# EAGLE design IO4-DCC-Booster (EAGLE 7.7.0)
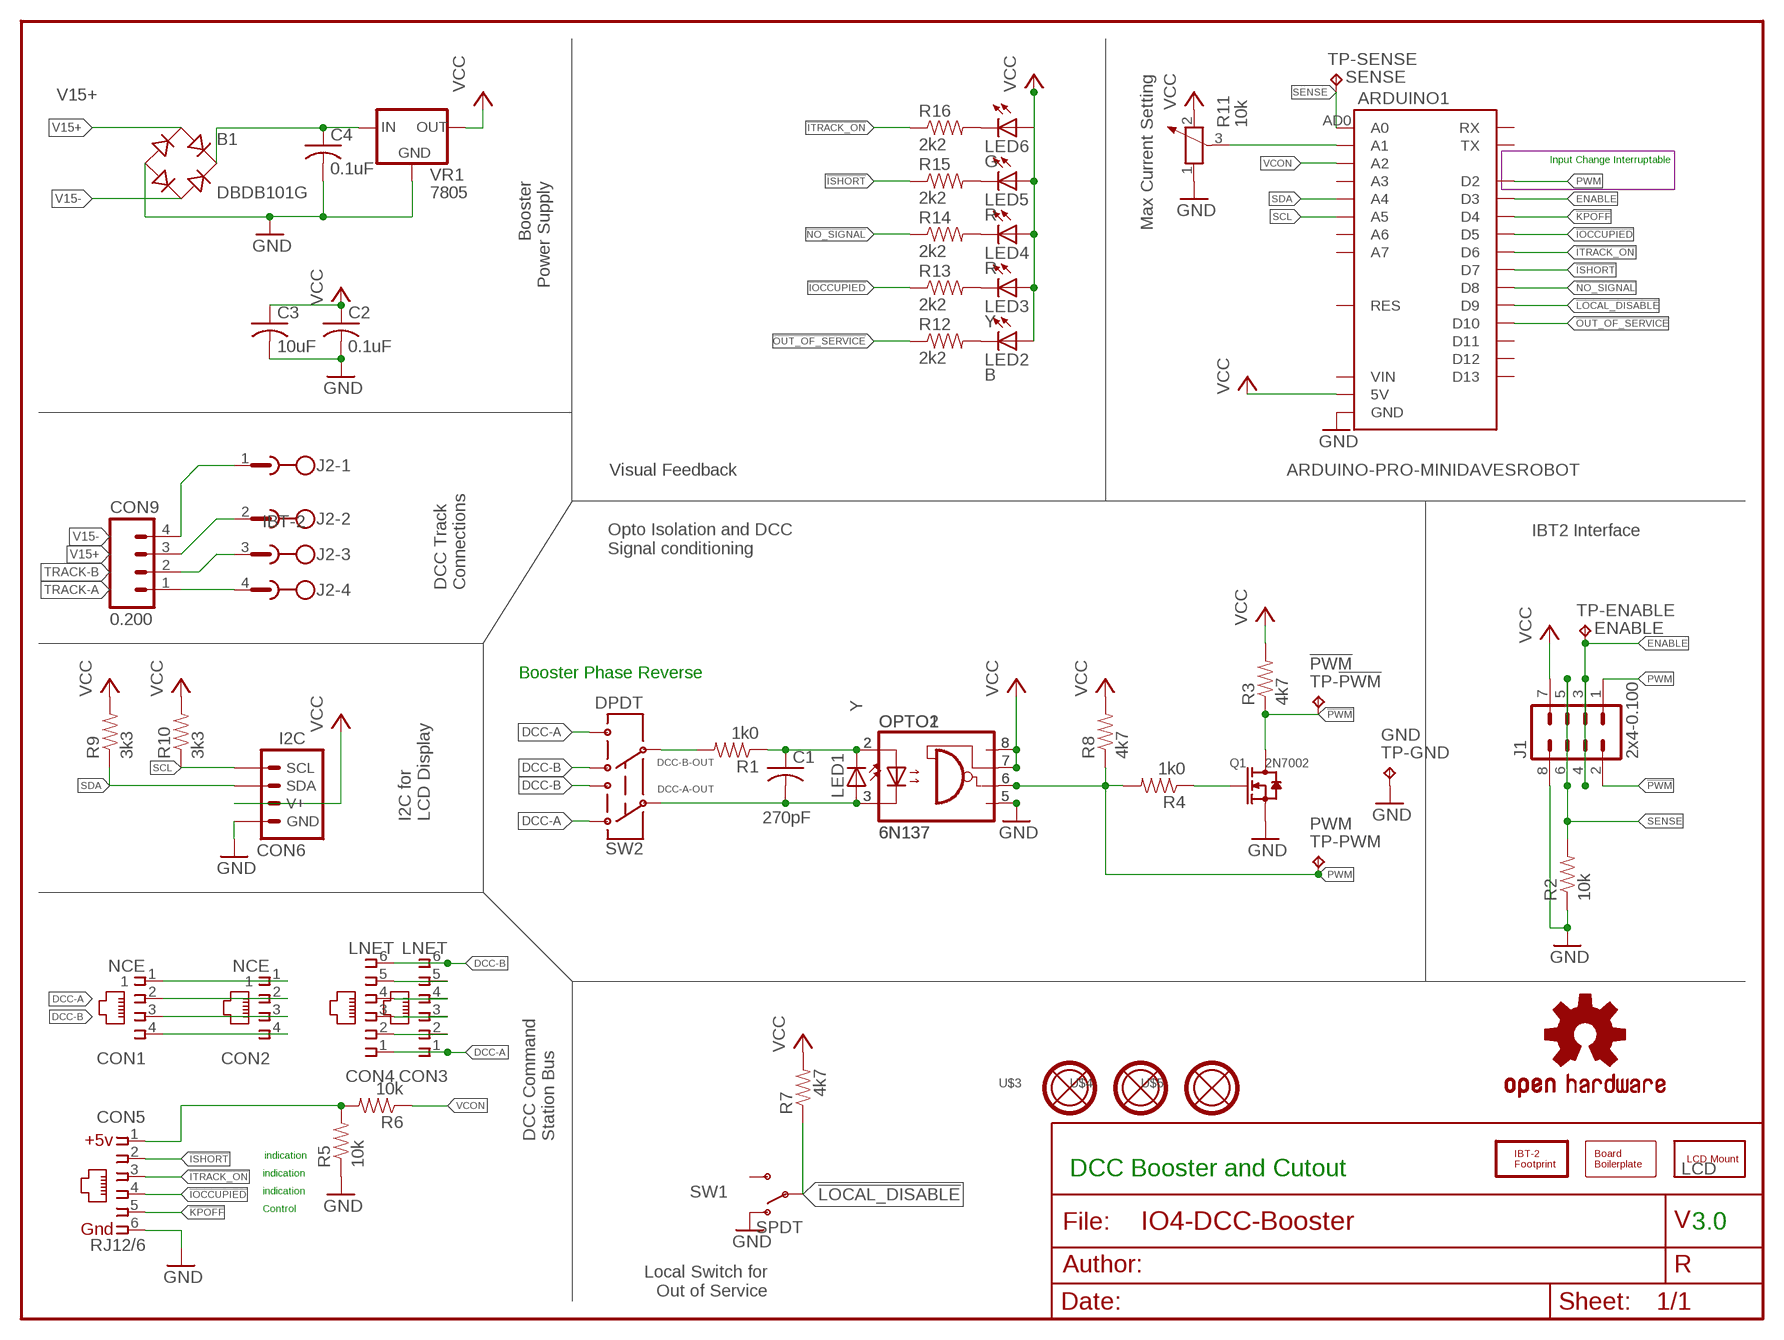
[diagram p0: schematic, sheet 1]

## Parts
ARDUINO1  ARDUINO-PRO-MINIDAVESROBOT  [ARDUINO_PRO_MINI_DAVEK]
B1  DBDB101G  [DB]
BOARD1  BOARD100X100-NOHOLES  [BOARD-SEEED10X10-NOHOLES]
C1  270pF  CAP0805  [0805-CAP]
C2  0.1uF  CAP0805  [0805-CAP]
C3  10uF  CAP0805  [0805-CAP]
C4  0.1uF  CAP0805  [0805-CAP]
CON1  NCE  CONNECTOR-RJ9-4P4C-AMP  [555980-1]
CON2  NCE  CONNECTOR-RJ9-4P4C-AMP  [555980-1]
CON3  LNET  CONNECTOR-RJ25-6P6C  [RJ25-PANEL]
CON4  LNET  CONNECTOR-RJ25-6P6C  [RJ25-PANEL]
CON5  RJ12/6  CONNECTOR-IO4PNL  [RJ25-PANEL]
CON6  I2C  CONNECTOR-I2CLEFT  [I2C-L]
CON9  0.200  CONNECTOR-M045.08  [MSTBA4]
J1  2x4-0.100  MA04-2  [MA04-2]
J2  IBT-2  MSTBA4  [MSTBA4]
LCD  LCD  LCD1602  [LCD-16X2-SILK]
LED1  Y  LED0603-LED  [0603-LED]
LED2  B  LED0603-LED  [0603-LED]
LED3  Y  LED0603-LED  [0603-LED]
LED4  R  LED0603-LED  [0603-LED]
LED5  R  LED0603-LED  [0603-LED]
LED6  G  LED0603-LED  [0603-LED]
LOGO1  DOC-OSHW-LOGO-L  [OSHW-LOGO-L]
OPTO1  6N137  OPTO-6N137  [DIL08]
OPTO2  6N137  OPTO-6N137S  [SM8]
Q1  2N7002  MOSFET-N-2N7002-SOT23  [SOT23]
R1  1k0  R0805-RES  [0805-RES]
R2  10k  R0805-RES  [0805-RES]
R3  4k7  R0805-RES  [0805-RES]
R4  1k0  R0805-RES  [0805-RES]
R5  10k  R0805-RES  [0805-RES]
R6  10k  R0805-RES  [0805-RES]
R7  4k7  R0805-RES  [0805-RES]
R8  4k7  R0805-RES  [0805-RES]
R9  3k3  R0805-RES  [0805-RES]
R10  3k3  R0805-RES  [0805-RES]
R11  10k  R-POTENTIOMETERB25X  [B25X]
R12  2k2  R0805-RES  [0805-RES]
R13  2k2  R0805-RES  [0805-RES]
R14  2k2  R0805-RES  [0805-RES]
R15  2k2  R0805-RES  [0805-RES]
R16  2k2  R0805-RES  [0805-RES]
SW1  SPDT  SWITCH-SPSTPTH-508  [SWITCH-SPDT-508]
SW2  DPDT  SWITCH-DPDTPTH-PB  [8X8-SQ-PB]
TP-!PWM  TPPAD1-13  [P1-13]
TP-ENABLE  TPPAD1-13  [P1-13]
TP-GND  TPPAD1-13  [P1-13]
TP-PWM  TPPAD1-13  [P1-13]
TP-SENSE  TPPAD1-13  [P1-13]
U$2  IBT-2  [IBT-2]
U$3  MOUNTINGHOLE  [MOUNTINGHOLE]
U$4  MOUNTINGHOLE  [MOUNTINGHOLE]
U$5  MOUNTINGHOLE  [MOUNTINGHOLE]
VR1  7805  VREG-DPAK-5  [TO-252]

## Nets
!IOCCUPIED: ARDUINO1.D5 CON5.4 R13.1
!ISHORT: ARDUINO1.D7 CON5.2 R15.1
!ITRACK_ON: ARDUINO1.D6 CON5.3 R16.1
!KPOFF: ARDUINO1.D4 CON5.5
!LOCAL_DISABLE: ARDUINO1.D9 R7.1 SW1.2(P)
!NO_SIGNAL: ARDUINO1.D8 R14.1
!OUT_OF_SERVICE: ARDUINO1.D10 R12.1
!PWM: J1.2 Q1.3(D) R3.1 TP-!PWM.TP
DCC-A: CON1.2 CON2.2 CON3.1 CON4.1 SW2.1A SW2.2B
DCC-A-OUT: C1.2 LED1.A OPTO1.3(C) OPTO2.3(C) SW2.1C
DCC-B: CON1.3 CON2.3 CON3.6 CON4.6 SW2.1B SW2.2A
DCC-B-LIMITED: C1.1 LED1.C OPTO1.2(A) OPTO2.2(A) R1.1
DCC-B-OUT: R1.2 SW2.2C
ENABLE: ARDUINO1.D3 J1.3 J1.4 TP-ENABLE.TP
GND: ARDUINO1.GND@1(GND) ARDUINO1.GND@2(GND) ARDUINO1.GND@4(GND) B1.- C2.2 C3.2 C4.2 CON5.6 CON6.GND CON6.GND@1(GND) J1.8 OPTO1.5(GND) OPTO2.5(GND) Q1.2(S) R2.1 R5.1 R11.1 SW1.1(O) TP-GND.TP VR1.2(GND)
LIMIT: ARDUINO1.AD1(A1) R11.3
N$1: Q1.1(G) R4.1
N$6: CON1.4 CON2.4
N$7: CON1.1 CON2.1
N$8: CON3.5 CON4.5
N$9: CON3.4 CON4.4
N$10: LED4.C R14.2
N$11: CON3.3 CON4.3
N$12: LED2.C R12.2
N$13: LED3.C R13.2
N$14: LED6.C R16.2
N$15: LED5.C R15.2
N$16: CON3.2 CON4.2
N$19: B1.+ C4.1 VR1.1(IN)
PWM: ARDUINO1.D2 J1.1 OPTO1.6(VO) OPTO2.6(VO) R4.2 R8.1 TP-PWM.TP
SCL: ARDUINO1.AD5(A5) CON6.SCL CON6.SCL@1(SCL) R10.1
SDA: ARDUINO1.AD4(A4) CON6.SDA CON6.SDA@1(SDA) R9.1
SENSE: ARDUINO1.AD0(A0) J1.5 J1.6 R2.2 TP-SENSE.TP
TRACK-A: CON9.1 J2.4
TRACK-B: CON9.2 J2.3
V15+: B1.AC1 CON9.3 J2.2
V15-: B1.AC2 CON9.4 J2.1
VCC: ARDUINO1.5V C2.1 C3.1 CON6.V+ CON6.V+@1(V+) J1.7 LED2.A LED3.A LED4.A LED5.A LED6.A OPTO1.7(VE) OPTO1.8(VCC) OPTO2.7(VE) OPTO2.8(VCC) R3.2 R7.2 R8.2 R9.2 R10.2 R11.2 VR1.3(OUT)
VCOMPUTER: CON5.1 R5.2 R6.2
VCON: ARDUINO1.AD2(A2) R6.1
Unconnected: ARDUINO1.AD3(A3) ARDUINO1.AD6(A6) ARDUINO1.AD7(A7) ARDUINO1.D11 ARDUINO1.D12 ARDUINO1.D13 ARDUINO1.RES ARDUINO1.RES@1(RES) ARDUINO1.RX ARDUINO1.TX@1(TX) ARDUINO1.VIN SW1.3(S)

## Notes on the sheet
- Max Current Setting
- Input Change Interruptable
- Booster
  Power Supply
- Visual Feedback
- IBT2 Interface
- Opto Isolation and DCC
  Signal conditioning
- DCC Track
  Connections
- Booster Phase Reverse
- I2C for
  LCD Display
- DCC Command
  Station Bus
- indication
- indication | DCC Booster and Cutout
- indication
- Control
- 3.0
- Local Switch for
  Out of Service

## Library data of the parts
ARDUINO1 = SPCoast:ARDUINO-PRO-MINI
B1 = SPCoast:DB?*G: Single Phase 1.0 AMP Glass Passivated Bridge Rectifier Taiwan Semiconductor Co.,Ltd. - TSC Source: http://www.taiwansemi.com/TSCbig5/ezcatfiles/cust/img/img/db101g.pdf http://www.ts.com.tw/db/pictures/modules/PDT/PDT060207001/DBLS201G.pdf
BOARD1 = SPCoast:BOARD
C1-C4 = SPCoast:CAP*
CON1 CON2 = SPCoast:CONNECTOR-RJ9: RJ9 4P4C jack side mounted The four-position four-conductor (4P4C) connector is the standard modular connector used on both ends of telephone handset cords, and is therefore often called a handset connector. This handset connector is not a registered jack (aka "RJ"), because it was not intended to connect directly to telephone lines. However it is often referred to as RJ9, RJ10, or RJ22. http://www.tycoelectronics.com
CON3 CON4 = SPCoast:CONNECTOR-RJ25: AMP connector; AMP: 520250-3; OPL: none
CON5 = SPCoast:CONNECTOR-IO4
CON6 = SPCoast:CONNECTOR-I2C
CON9 = SPCoast:CONNECTOR-M04: Header 4 Standard 4-pin 0.1" header. Use with straight break away headers (SKU : PRT-00116), right angle break away headers (PRT-00553), swiss pins (PRT-00743), machine pins (PRT-00117), and female headers (PRT-00115). Molex polarized connector foot print use with SKU : PRT-08231 with associated crimp pins and housings. 1MM SMD Version SKU: PRT-10208
J1 = con-lstb:MA04-2: PIN HEADER; OC_FARNELL: unknown; OC_NEWARK: unknown
J2 = con-phoenix-508:MSTBA4: PHOENIX; MF: FARNELL; MPN: 1757268; OC_FARNELL: 3705195; OC_NEWARK: 71C4163
LCD = SPCoast:LCD
LED1-LED6 = SPCoast:LED*
LOGO1 = SPCoast:DOC-OSHW-LOGO-: Open Source Hardware Logo This logo indicates the piece of hardware it is found on incorporates a OSHW license and/or adheres to the definition of open source hardware http://freedomdefined.org/OSHW Creative Commons - Attribution - ShareAlike 3.0
OPTO1 OPTO2 = SPCoast:OPTO-6N137: High Speed OPTO COUPLER Logic Gate output
Q1 = SPCoast:MOSFET-N-*-?: CJ2302：SMD MOSFET N-CH 20V-2.1A DMN4468 - SO8 30v/10A
R1-R10 R12-R16 = SPCoast:R*: Resistor Basic schematic elements and footprints for 0603, 1206, and PTH 1/10th watt (small) resistors.
R11 = SPCoast:R-POTENTIOMETER: Potentiometer
SW1 = SPCoast:SWITCH-SPST: SPST Switch Simple slide switch. Spark Fun Electronics SKU : COM-00102
SW2 = SPCoast:SWITCH-DPDT: DPDT Version of the COM-00597
TP-!PWM = testpad:TP: Test pad; TP_SIGNAL_NAME: !PWM
TP-ENABLE = testpad:TP: Test pad; TP_SIGNAL_NAME: ENABLE
TP-GND = testpad:TP: Test pad; TP_SIGNAL_NAME: GND
TP-PWM = testpad:TP: Test pad; TP_SIGNAL_NAME: PWM
TP-SENSE = testpad:TP: Test pad; TP_SIGNAL_NAME: SENSE
U$2 = SPCoast:IBT-2
U$3-U$5 = SPCoast:MOUNTINGHOLE: Mounting hole with top and bottom copper and stop rings
VR1 = SPCoast:VREG-?-*: Voltage Regulator Standard linear regulator. 7805 uses IGO pinout LM1117 uses GOI pinout

## Net classes
1 Power: width 0.305 mm, clearance 0.254 mm

## Board
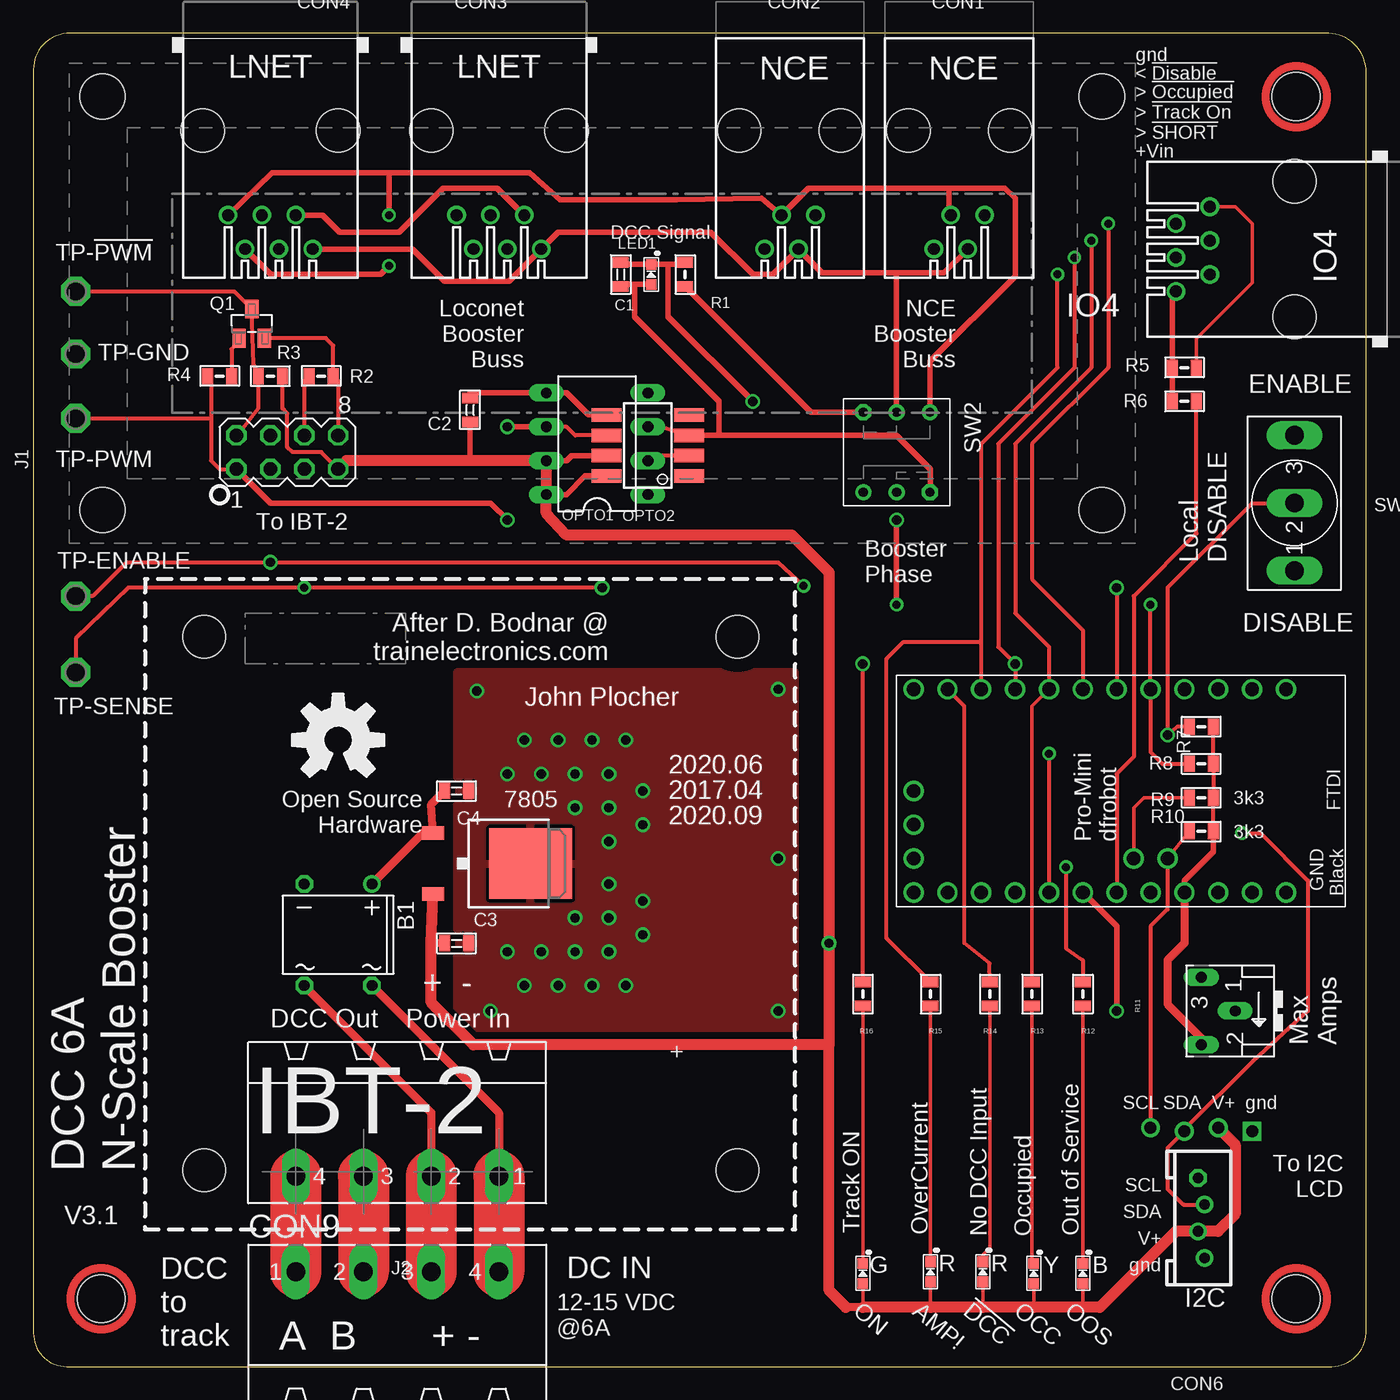
[diagram p1: board, top side]
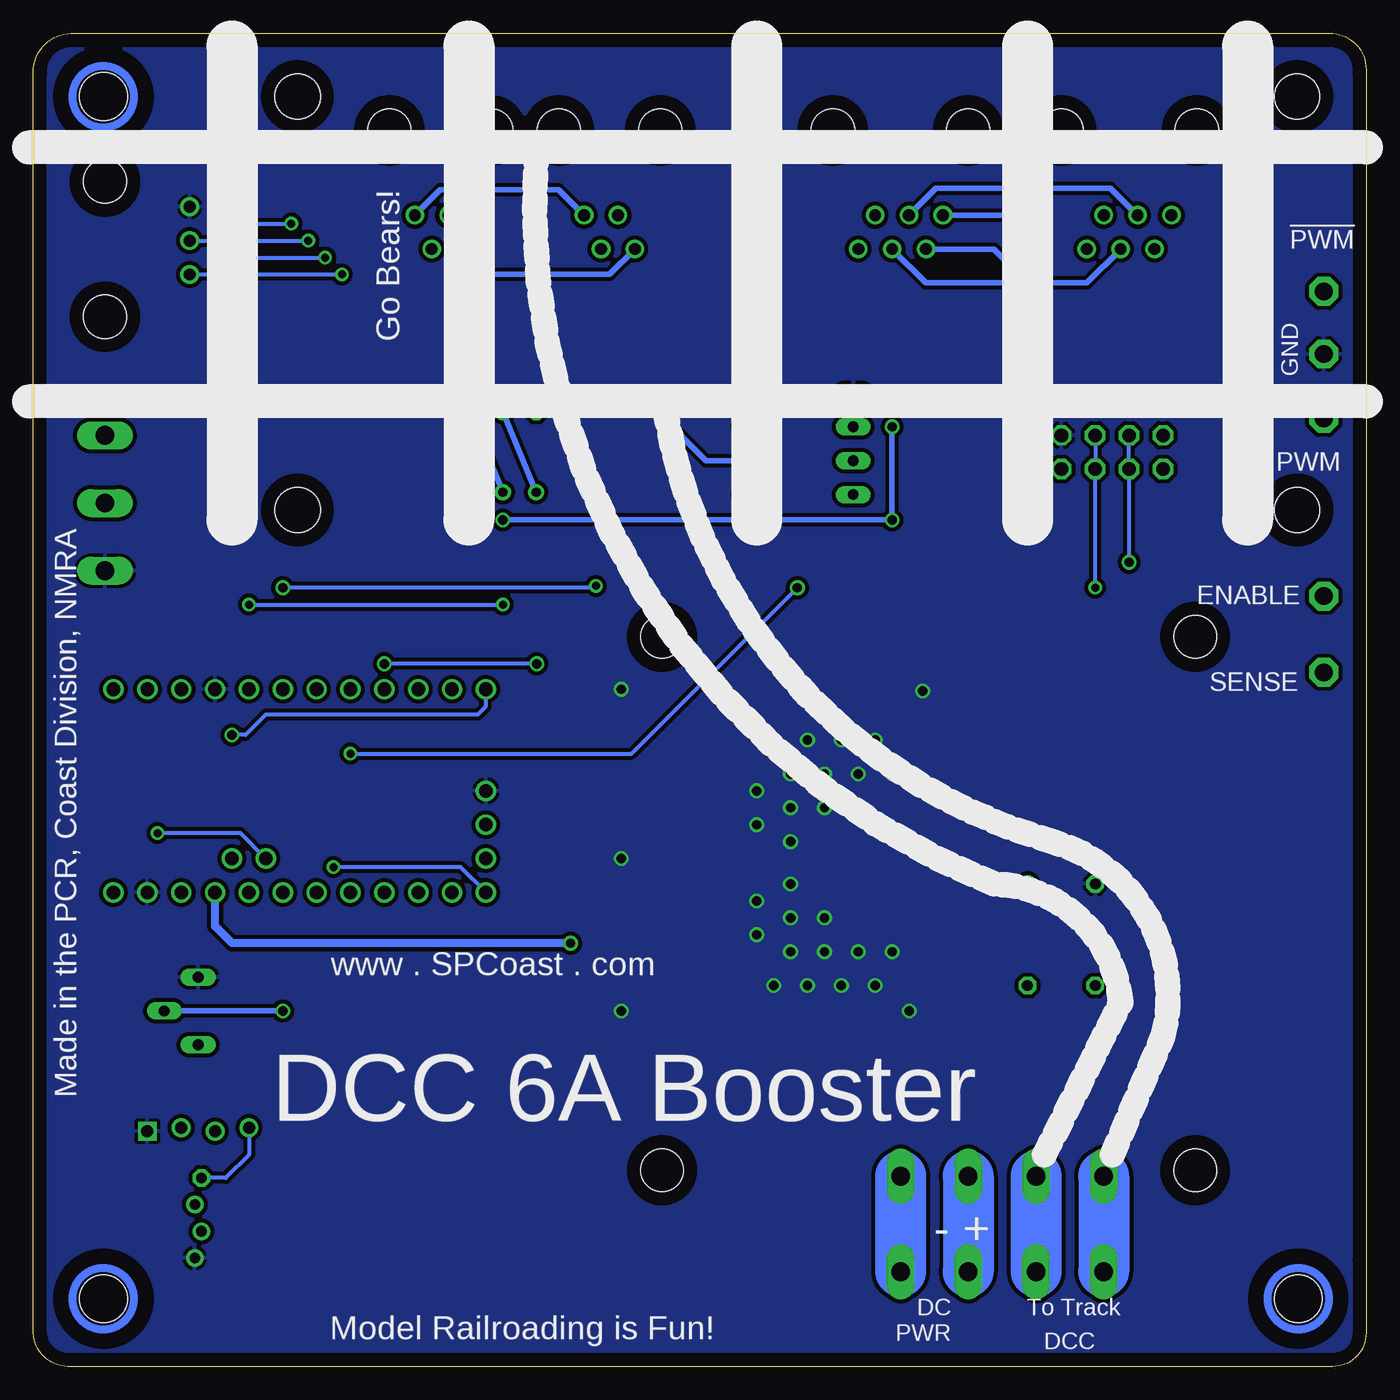
[diagram p2: board, bottom side, seen from below]

Size 100.01 x 100 mm. Coordinates in mm from the lower left corner, seen from the top.
Copper layers (1*16): Top 0.035mm / dielectric 1.5mm / Bottom 0.035mm
Design rules "default": minimum track width 10mil, minimum drill 0.6mm, track to track 8mil, track to pad 8mil, pad to pad 8mil, via to via 8mil, smd to smd 8mil, copper to edge 40mil, drill to drill 8mil, minimum pad ring 10mil, minimum via ring 8mil, stop-mask expansion 4mil, vias tented up to drill 0mil, thermal gap 10mil
vRestrict: area 6.4,3.8 to 56.4,53.8

### Footprints (pad centres in the part's own frame; a part is rotated, then mirrored left to right if it is on the bottom)
ARDUINO_PRO_MINI_DAVEK = drill 1.016: 5V 16.51,21.59; AD0 16.51,11.43; AD1 16.51,13.97; AD2 16.51,16.51; AD3 16.51,19.05; AD4 13.97,17.78; AD5 13.97,20.32; AD6 11.43,1.27; AD7 13.97,1.27; D2 1.27,19.05; D3 1.27,16.51; D4 1.27,13.97; D5 1.27,11.43; D6 1.27,8.89; D7 1.27,6.35; D8 1.27,3.81; D9 1.27,1.27; D10 16.51,1.27; D11 16.51,3.81; D12 16.51,6.35; D13 16.51,8.89; GND@1 16.51,26.67; GND@2 8.89,1.27; GND@4 1.27,21.59; RES 16.51,24.13; RES@1 1.27,24.13; RX 1.27,26.67; TX@1 1.27,29.21; VIN 16.51,29.21
DB = drill 0.813: + -2.54,-3.81 | drill 0.813 octagon: - 2.54,-3.81; AC1 2.54,3.81; AC2 -2.54,3.81
0805-CAP = smd 0.8 x 1.2: 1 -0.9,0; 2 0.9,0
555980-1 = drill 0.889: 1 -1.905,6.35; 2 -0.635,8.89; 3 0.635,6.35; 4 1.905,8.89 | hole 3.251: -3.81,0; 3.81,0
RJ25-PANEL = drill 0.889: 1 -3.175,8.89; 2 -1.905,6.35; 3 -0.635,8.89; 4 0.635,6.35; 5 1.905,8.89; 6 3.175,6.35 | hole 3.251: -5.08,0; 5.08,0
I2C-L = drill 0.9 square: GND 3.81,-0.127 | drill 0.8 pad 1.27: GND@1 0.254,-9.635; SDA@1 0.254,-5.635; V+@1 -0.254,-7.635 | drill 0.9: SCL -3.81,0.127; SDA -1.27,-0.127; V+ 1.27,0.127 | drill 0.8 pad 1.27 octagon: SCL@1 -0.254,-3.635
MSTBA4 = drill 1.397 long: 1 -7.62,5.08; 2 -2.54,5.08; 3 2.54,5.08; 4 7.62,5.08
MA04-2 = drill 1.016 octagon: 1 -3.81,-1.27; 2 -3.81,1.27; 3 -1.27,-1.27; 4 -1.27,1.27; 5 1.27,-1.27; 6 1.27,1.27; 7 3.81,-1.27; 8 3.81,1.27
LCD-16X2-SILK = hole 3.4: -37.5,15.5; -37.5,-15.5; 37.5,15.5; 37.5,-15.5
0603-LED = smd 0.8 x 0.8: A 0.75,0; C -0.75,0
DIL08 = drill 0.813 long: 1 -3.81,-3.81; 2 -1.27,-3.81; 3 1.27,-3.81; 4 3.81,-3.81; 5 3.81,3.81; 6 1.27,3.81; 7 -1.27,3.81; 8 -3.81,3.81
SM8 = smd 1.016 x 2.235: 1 -2.286,-3.099; 2 -0.762,-3.099; 3 0.762,-3.099; 4 2.286,-3.099; 5 2.286,3.099; 6 0.762,3.099; 7 -0.762,3.099; 8 -2.286,3.099
SOT23 = smd 1.4 x 1: 1 1.1,-0.95; 2 1.1,0.95; 3 -1.1,0
0805-RES = smd 0.8 x 1.2: 1 -0.9,0; 2 0.9,0
B25X = drill 0.813 long: 1 -2.54,-1.905; 2 2.54,-1.905; 3 0,0.635
SWITCH-SPDT-508 = drill 1.397 long: 1 -5.08,0; 2 0,0; 3 5.08,0
8X8-SQ-PB = drill 0.7: 1A 3,-2.5; 1B 3,0; 2A -3,2.5; 2B -3,0 | drill 0.7 octagon: 1C 3,2.5; 2C -3,-2.5
P1-13 = drill 1.321 pad 2.159 octagon: TP 0,0
IBT-2 = hole 3.2: -20.447,-20.447; 19.558,-20.447; 19.558,19.558; -20.447,19.558
MOUNTINGHOLE = hole 3.6: 0,0
TO-252 = smd 1.651 x 1.016: 1 -4.826,2.286; 3 -4.826,-2.286 | smd 6.2 x 5.3: 2 2.5,0

### Placement (x,y rotation side)
ARDUINO1  64.78,52.07 270 top
B1  22.87,32.39 180 top
BOARD1  0.01,0 0 top
C1  44.08,81.92 270 top
C2  32.78,71.76 90 top
C3  31.76,31.75 0 top
C4  31.76,43.18 0 top
CON1  69.48,92.71 180 top
CON2  56.78,92.71 180 top
CON3  34.93,92.71 180 top
CON4  17.79,92.71 180 top
CON5  94.62,83.82 90 top
CON6  87.64,17.78 0 top
CON9  27.31,2.04 0 top
J1  19.06,68.58 0 top
J2  27.31,19.36 180 top
LCD  42.68,79.76 0 top
LED1  46.36,81.92 270 top
LED2  78.75,6.99 270 top
LED3  75.07,6.99 270 top
LED4  71.26,7.12 270 top
LED5  67.32,7.12 270 top
LED6  62.24,6.99 270 top
LOGO1  22.87,46.99 0 top
OPTO1  42.3,69.22 90 top
OPTO2  46.11,69.09 90 top
Q1  16.39,78.24 270 top
R1  48.9,81.92 270 top
R2  21.6,74.3 180 top
R3  17.79,74.3 0 top
R4  13.98,74.3 180 top
R5  86.37,74.93 180 top
R6  86.37,72.39 180 top
R7  87.64,48.01 0 top
R8  87.64,45.22 0 top
R9  87.64,42.68 0 top
R10  87.64,40.14 0 top
R11  89.54,26.67 270 top
R12  78.75,27.94 270 top
R13  74.94,27.94 270 top
R14  71.76,27.94 270 top
R15  67.32,27.94 270 top
R16  62.24,27.94 270 top
SW1  94.62,64.77 90 top
SW2  64.78,68.58 270 top
TP-!PWM  3.18,80.65 270 top
TP-ENABLE  3.18,57.79 0 top
TP-GND  3.18,75.95 0 top
TP-PWM  3.18,71.12 180 top
TP-SENSE  3.18,52.07 0 top
U$2  32.39,34.29 180 top
U$3  5.09,5.08 0 top
U$4  94.75,5.08 0 top
U$5  94.75,95.25 0 top
VR1  34.81,37.72 0 top

### Tracks (layer width: path | path; a pad name or v marks a point on that pad's centre or on a via)
!IOCCUPIED  (via drill 0.6)
  Top 0.254: ARDUINO1.D5 74.94,49.53 R13.1
  Top 0.305: v79.38,84.46 79.38,74.93 73.67,69.22 73.67,56.52 76.21,53.98 ARDUINO1.D5
  Bottom 0.305: CON5.4 v79.38,84.46
!ISHORT  (via drill 0.6)
  Top 0.305: R15.1 67.19,28.96 64.02,32.13 64.02,53.09 65.29,54.36 71.13,54.36 | ARDUINO1.D7 71.13,54.36 | 71.13,54.36 71.13,69.22 76.84,74.93 v76.84,81.92
  Bottom 0.305: CON5.2 v76.84,81.92
!ITRACK_ON  (via drill 0.6, 0.7)
  Top 0.305: R16.1 v62.24,52.71 | v78.11,83.19 78.11,74.93 72.4,69.22 72.4,53.98 v73.67,52.71 ARDUINO1.D6
  Bottom 0.305: v62.24,52.71 v73.67,52.71 | CON5.3 v78.11,83.19
!KPOFF  (via drill 0.6)
  Top 0.305: v80.65,85.73 80.65,74.93 74.94,69.22 74.94,59.06 78.75,55.25 ARDUINO1.D4
  Bottom 0.305: CON5.5 v80.65,85.73
!LOCAL_DISABLE  (via drill 0.7)
  Top 0.305: R7.1 85.86,48.01 v85.1,47.37 85.1,58.42 91.45,64.77 SW1.2
  Bottom 0.305: v85.1,47.37 84.08,47.37 82.56,48.9 66.68,48.9 66.05,49.53 ARDUINO1.D9
!NO_SIGNAL
  Top 0.305: R14.1 71.75,30.24 69.86,31.75 69.86,49.53 ARDUINO1.D8
!OUT_OF_SERVICE  (via drill 0.6)
  Top 0.305: v77.48,37.47 77.48,31.38 78.75,30.48 R12.1
  Bottom 0.305: ARDUINO1.D10 67.95,37.47 v77.48,37.47
!PWM
  Top 0.305: J1.2 15.62,70.22 16.9,71.89 R3.1 16.52,75.2 Q1.3 | Q1.3 16.44,79.12 | TP-!PWM.TP 15.08,80.65 Q1.3
DCC-A
  Top 0.406: 64.78,82.05 59.19,82.05 CON2.2 55.51,81.92 53.98,81.92 50.81,85.09 39.38,85.09 CON3.1 35.7,81.41 30.87,81.41 28.46,83.82 CON4.1 | 64.78,82.05 68.34,82.05 CON1.2 | SW2.2B 64.78,82.05
  Bottom 0.406: SW2.2B SW2.1A
DCC-A-OUT
  Top 0.305: OPTO2.3 47,70.49 arc32 OPTO1.3
  Top 0.406: OPTO2.3 51.44,69.85 | 51.44,69.85 64.78,69.85 67.32,67.31 67.32,65.62 SW2.1C | LED1.A 45.09,81.17 | 45.09,81.17 44.23,81.17 C1.2 | 51.44,69.85 51.44,72.39 45.09,78.74 45.09,81.17
DCC-B  (via drill 0.6)
  Top 0.305: 68.72,86.49 arc90 CON1.3
  Top 0.406: 68.72,88.4 58.18,88.4 CON2.3 54.62,87.63 48.27,87.51 39.51,87.51 37.22,89.54 26.68,89.54 | 68.72,88.4 68.72,86.49 | CON4.6 17.92,89.54 26.68,89.54 | v26.68,86.36 26.68,89.54 | 68.72,88.4 72.91,88.4 73.67,87.63 73.67,81.78 67.28,75.39 SW2.2A
  Bottom 0.406: CON3.6 v26.68,86.36 | SW2.2A SW2.1B
DCC-B-LIMITED  (via drill 0.7)
  Top 0.305: OPTO2.2 46.49,68.33 OPTO1.2
  Top 0.406: C1.1 44.23,82.67 LED1.C 47.63,82.67 | R1.1 48.75,82.67 47.63,82.67 | v53.98,72.39 47.63,78.74 47.63,82.67
  Bottom 0.406: v53.98,72.39 49.54,67.95 OPTO1.2
DCC-B-OUT
  Top 0.406: R1.2 58.34,71.58 SW2.2C
ENABLE  (via drill 0.6, 0.7)
  Top 0.305: v57.79,58.55 55.89,60.33 v17.79,60.33 6.99,60.33 4.45,57.79 TP-ENABLE.TP | v81.29,58.42 ARDUINO1.D3
  Bottom 0.305: J1.4 J1.3 v17.79,60.33 | v57.79,58.55 57.79,58.42 v81.29,58.42
GND  (via drill 0.7)
  Top 0.254: CON5.6 90.18,87 91.45,85.73 91.45,81.28 87.27,77.1 R5.1
  Top 0.305: J1.8 22.87,73.93 R2.1 22.5,76.57 21.94,77.14 Q1.2
  Top 0.406: C2.2 32.78,73.03 OPTO1.5 40.01,73.03 41.67,71.38 OPTO2.5
  other vias: 35.57,44.45 38.11,44.45 40.65,44.45 35.57,31.12 38.11,31.12 40.65,31.12 43.19,33.66 43.19,41.91 43.19,39.37 43.19,36.2 36.84,46.99 39.38,46.99 41.92,46.99 36.84,28.58 39.38,28.58 41.92,28.58 43.19,31.12 43.19,44.45 44.46,46.99 44.46,28.58 45.73,43.18 45.73,40.64 45.73,32.39 45.73,34.93 40.65,33.66 40.65,41.91 55.89,50.8 55.89,26.67 55.89,38.1 33.28,50.68 34.3,26.67
  pour Bottom (isolate 0.305): 0.01,99.7 100.34,99.7 100.34,0 0.01,0
  pour Top (isolate 0.406): 31.76,52.07 31.76,25.4 57.16,25.4 57.16,52.07
LIMIT  (via drill 0.7)
  Top 0.406: ARDUINO1.AD1 81.29,33.02 v81.29,26.67
  Bottom 0.406: v81.29,26.67 R11.3
N$1
  Top 0.305: Q1.1 14.88,76.32 R4.1
N$6
  Bottom 0.305: 67.45,83.82 CON1.4
  Bottom 0.406: CON2.4 56.78,81.92 65.54,81.92 67.45,83.82
N$7
  Bottom 0.406: CON1.1 69.48,88.27 60.59,88.27 CON2.1
N$8  (via drill 0.6)
  Top 0.406: v26.68,82.55 26.04,81.92 17.79,81.92 CON4.5
  Bottom 0.406: CON3.5 27.95,83.82 v26.68,82.55
N$9
  Bottom 0.406: CON4.4 19.19,88.4 32.27,88.4 CON3.4
N$10
  Top 0.254: R14.2 71.76,8.89 71.24,8.37 LED4.C
N$11
  Bottom 0.406: CON3.3 33.03,81.28 20.96,81.28 CON4.3
N$12
  Top 0.254: R12.2 LED2.C
N$13
  Top 0.254: R13.2 74.94,9.53 74.93,7.74 LED3.C
N$14
  Top 0.254: R16.2 LED6.C
N$15
  Top 0.254: R15.2 LED5.C
N$16
  Top 0.406: CON3.2 34.81,88.4 30.74,88.4 27.44,85.09 23,85.09 21.73,86.36 CON4.2
N$19
  Top 0.61: C4.1 29.85,42.18 VR1.1 29.35,40.14 B1.+
PWM  (via drill 0.6, 0.7)
  Top 0.305: R8.1 84.72,45.22 83.83,46.1 ARDUINO1.D2 v83.83,57.15 | OPTO2.6 40.65,69.85 40.01,70.49 OPTO1.6 | R4.2 13.34,74.03 13.34,71.12 | 13.34,71.12 13.34,67.95 13.98,67.31 J1.1 | TP-PWM.TP 13.34,71.12
  Top 0.406: J1.1 17.79,64.77 34.3,64.77 v35.57,63.5 | v35.57,70.49 OPTO1.6 | v64.78,63.5 v64.78,57.15
  Bottom 0.305: v83.83,57.15 v64.78,57.15
  Bottom 0.406: v35.57,70.49 v35.57,63.5 v64.78,63.5
SCL
  Top 0.254: ARDUINO1.AD5 R10.1
  Top 0.305: ARDUINO1.AD5 85.1,34.29 83.83,33.02 CON6.SCL
  Bottom 0.305: CON6.SCL 83.83,15.88 85.56,14.15 CON6.SCL@1
SDA  (via drill 0.6)
  Top 0.254: ARDUINO1.AD4 82.56,41.91 83.32,42.68 R9.1
  Top 0.305: v90.69,40.01 92.08,40.01 95.64,36.45 95.64,26.67 91.45,22.86 86.37,17.78 CON6.SDA 85.1,16.39 85.1,13.34 86.29,12.15 CON6.SDA@1
  Bottom 0.305: ARDUINO1.AD4 84.46,40.01 v90.69,40.01
SENSE  (via drill 0.6, 0.7)
  Top 0.305: v76.21,45.98 ARDUINO1.AD0 | R2.2 20.33,73.93 J1.6 | TP-SENSE.TP 3.18,54.61 7.12,58.42 v20.33,58.42 v42.68,58.42
  Bottom 0.305: J1.6 J1.5 v20.33,58.42 | v76.21,45.98 55.13,45.98 v42.68,58.42
TRACK-A
  Top 3.81: J2.4 CON9.1
  Bottom 3.81: J2.4 CON9.1
TRACK-B
  Top 3.81: J2.3 CON9.2
  Bottom 3.81: J2.3 CON9.2
V15+
  Top 0.61: B1.AC1 29.85,19.05 J2.2
  Top 3.81: J2.2 CON9.3
  Bottom 3.81: J2.2 CON9.3
V15-
  Top 0.61: J2.1 34.93,19.05 B1.AC2
  Top 3.81: J2.1 CON9.4
  Bottom 3.81: J2.1 CON9.4
VCC  (via drill 0.7)
  Top 0.254: LED2.A 78.75,4.45 | LED3.A 75.07,4.45 | LED4.A 71.26,4.45 | LED5.A 67.32,4.45 | LED6.A 62.24,4.45
  Top 0.305: J1.7 21.6,68.58 19.44,68.58 19.06,68.96 19.06,71.5 18.69,71.87 R3.2 | R10.2 R9.2 R8.2 R7.2 | LED2.A 78.75,6.35 | 87.5,10.16 CON6.V+@1
  Top 0.406: ARDUINO1.5V 86.37,36.45 88.53,38.61 R10.2 | C2.1 32.78,68.08 32.9,67.95 | OPTO2.7 40.4,68.33 40.01,67.95 OPTO1.7 | OPTO2.8 41.41,66.81 40.01,65.41 OPTO1.8
  Top 0.61: ARDUINO1.5V 86.37,31.75 85.1,30.48 85.1,27.18 87.64,24.64 R11.2 | 62.24,4.45 60.97,4.45 | C3.1 29.85,31.75
  Top 0.813: J1.7 23.5,67.95 32.9,67.95 OPTO1.7 OPTO1.8 38.49,64.01 40.01,62.36 56.91,62.36 59.7,59.57 v59.7,31.75 59.7,24.13 | CON6.V+ 90.18,16.64 90.18,11.43 88.89,10.15 CON6.V+@1 | 87.5,10.16 85.73,10.16 80.02,4.45 78.75,4.45 75.07,4.45 71.26,4.45 67.32,4.45 62.24,4.45 | 60.97,4.45 59.7,5.72 59.7,24.13 | 59.7,24.13 33.03,24.13 29.85,27.31 29.85,31.75 VR1.3
  Bottom 0.61: v59.7,31.75 85.1,31.75 86.37,33.02 ARDUINO1.5V
VCOMPUTER
  Top 0.406: R6.2 R5.2 85.47,80.38 CON5.1
VCON
  Top 0.305: ARDUINO1.AD2 81.29,44.45 82.56,45.72 82.56,57.79 87.27,62.5 R6.1

### Text on the board
tPlace: gnd | < !Disable | > !Occupied | > !Track On | > !SHORT | +Vin | DCC Signal | IO4 | Loconet / Booster / Buss | NCE / Booster / Buss | IO4 | ENABLE | To IBT-2 | Local / DISABLE | Booster / Phase | After D. Bodnar @ / trainelectronics.com | DISABLE | John Plocher | 2020.06 | Open Source / Hardware | 7805 | 2017.04 | 2020.09 | Pro-Mini / dfrobot | + - | DCC Out | Power In | + | Max / Amps | To I2C / LCD | DCC 6A / N-Scale Booster | V3.1 | Track ON | OverCurrent | No DCC Input | Occupied | Out of Service | DC IN | ON | AMP! | !DCC | OCC | OOS | DCC / to / track | 12-15 VDC / @6A | A B | + -
bPlace: Go Bears! | GND | Made in the PCR, Coast Division, NMRA | www . SPCoast . com | DCC 6A Booster | - + | To Track | DC / PWR | Model Railroading is Fun! | DCC